# EAGLE design Babel Wing Rev A (EAGLE 9.4.2)
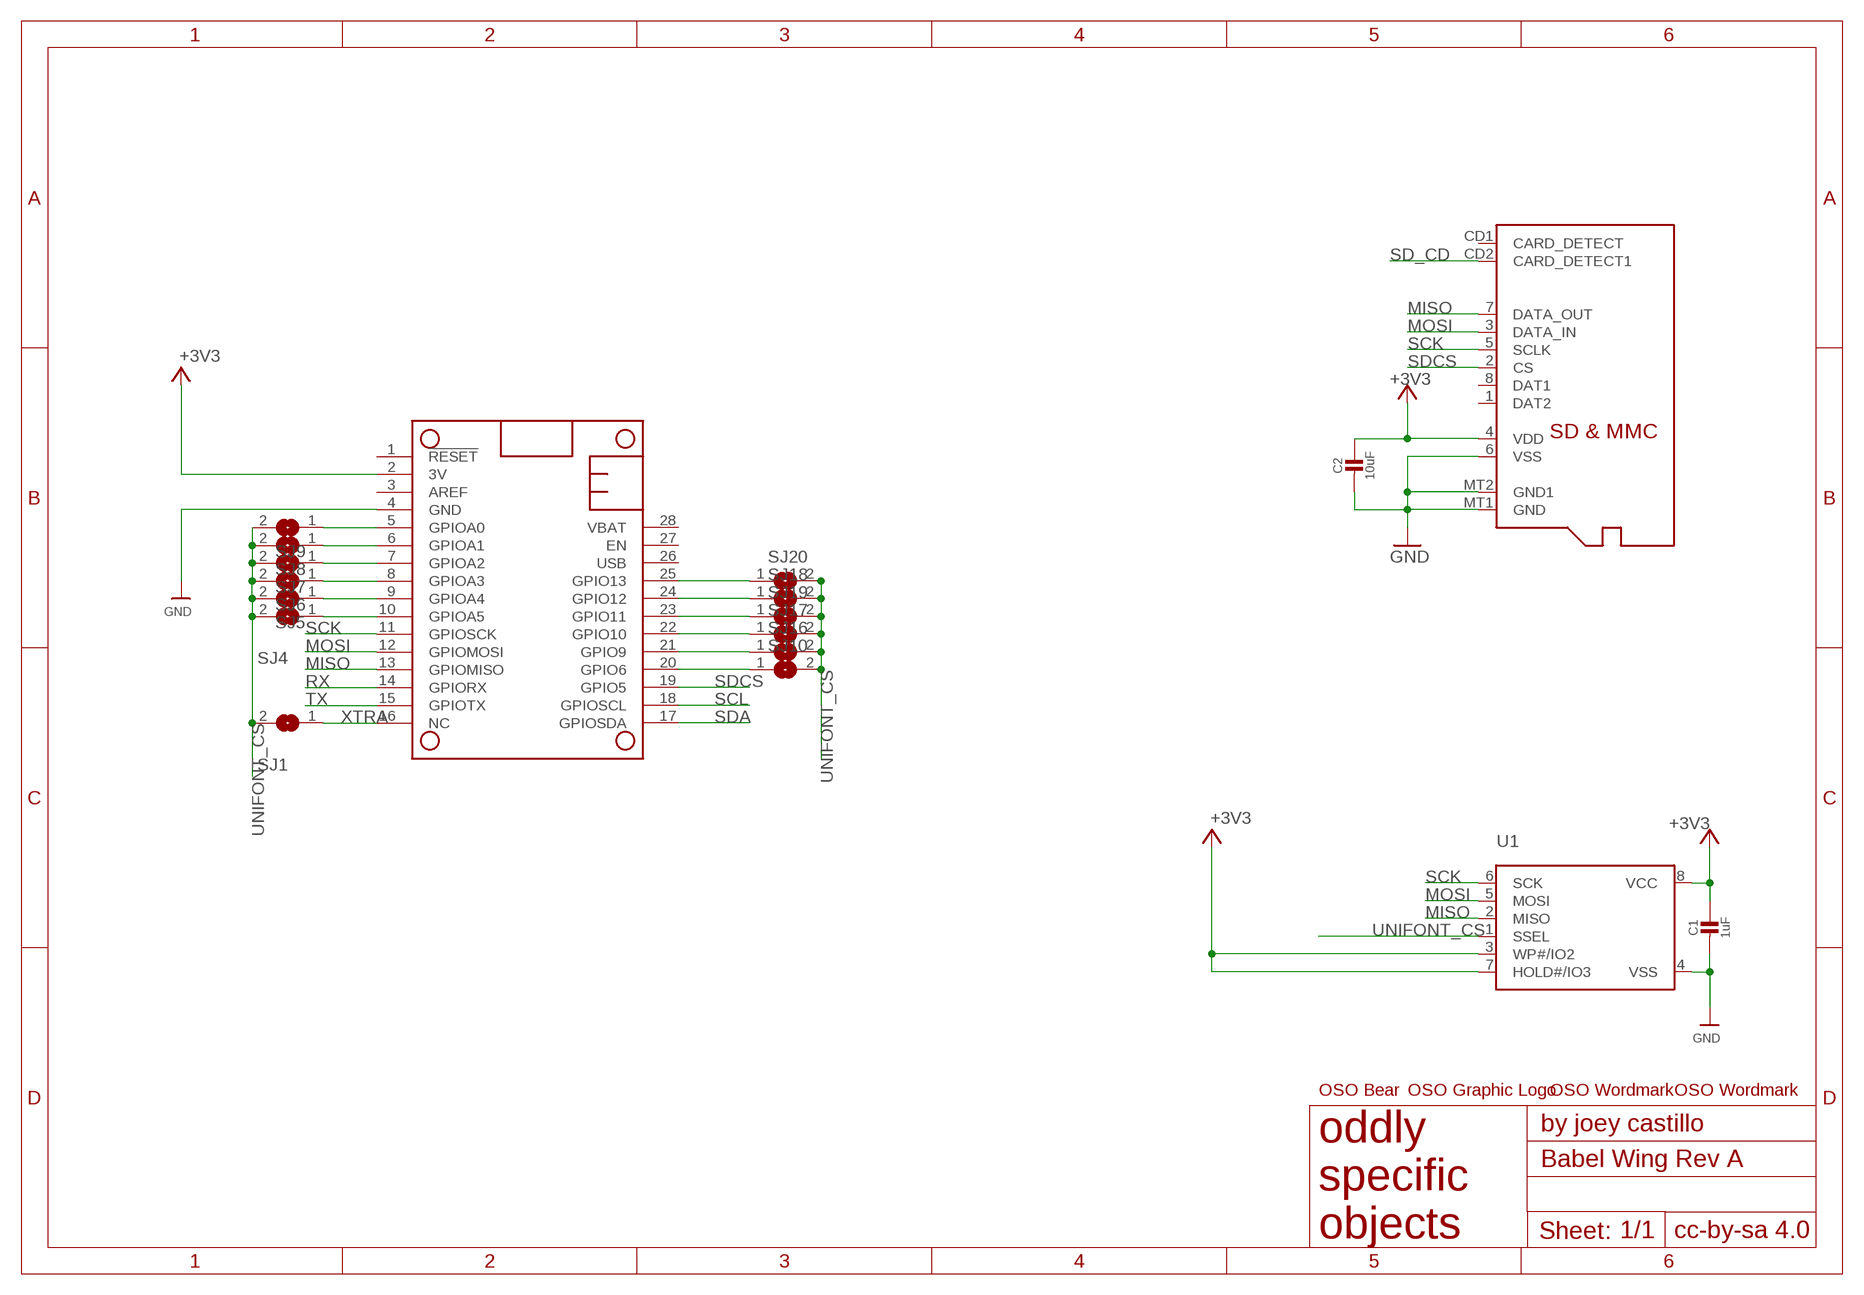
[diagram p0: schematic, sheet 1]

## Parts
C1  1uF  CAP_CERAMIC0805_10MGAP  [0805_10MGAP]
C2  10uF  CAP_CERAMIC0805_10MGAP  [0805_10MGAP]
MICROSD  MICROSD  [MICROSD]
MS1  FEATHERWING  [FEATHERWING]
SJ1  SOLDERJUMPER  [SOLDERJUMPER_ARROW_NOPASTE]
SJ4  SOLDERJUMPER  [SOLDERJUMPER_ARROW_NOPASTE]
SJ5  SOLDERJUMPER  [SOLDERJUMPER_ARROW_NOPASTE]
SJ6  SOLDERJUMPER  [SOLDERJUMPER_ARROW_NOPASTE]
SJ7  SOLDERJUMPER  [SOLDERJUMPER_ARROW_NOPASTE]
SJ8  SOLDERJUMPER  [SOLDERJUMPER_ARROW_NOPASTE]
SJ9  SOLDERJUMPER  [SOLDERJUMPER_ARROW_NOPASTE]
SJ10  SOLDERJUMPER  [SOLDERJUMPER_ARROW_NOPASTE]
SJ16  SOLDERJUMPER  [SOLDERJUMPER_ARROW_NOPASTE]
SJ17  SOLDERJUMPER  [SOLDERJUMPER_ARROW_NOPASTE]
SJ18  SOLDERJUMPER  [SOLDERJUMPER_ARROW_NOPASTE]
SJ19  SOLDERJUMPER  [SOLDERJUMPER_ARROW_NOPASTE]
SJ20  SOLDERJUMPER  [SOLDERJUMPER_ARROW_NOPASTE]
U1  MICROBUILDER_SPIFLASH_SOIC8  [MICROBUILDER_SOIC8_150MIL]
U$2  OSO_BEAR  [OSO_BEAR_750MIL]
U$3  OSO_GRAPHIC  [OSO_GRAPHIC]
U$4  OSO_TEXT  [OSO_TEXT_435MIL]
U$5  OSO_TEXTOSO_TEXT_ONELINE_125MIL  [OSO_ONELINE_125MIL]

## Nets
+3V3: C1.1 C2.1 MICROSD.4(VDD) MS1.2(3V) U1.3(WP#/IO2) U1.7(HOLD#/IO3) U1.8(VCC)
GND: C1.2 C2.2 MICROSD.6(VSS) MICROSD.MT1(GND) MICROSD.MT2(GND1) MS1.4(GND) U1.4(VSS)
MISO: MICROSD.7(DATA_OUT) MS1.13(GPIOMISO) U1.2(MISO)
MOSI: MICROSD.3(DATA_IN) MS1.12(GPIOMOSI) U1.5(MOSI)
N$4: MS1.20(GPIO6) SJ10.1
N$10: MS1.10(GPIOA5) SJ4.1
N$11: MS1.9(GPIOA4) SJ5.1
N$12: MS1.8(GPIOA3) SJ6.1
N$13: MS1.7(GPIOA2) SJ7.1
N$14: MS1.6(GPIOA1) SJ8.1
N$15: MS1.5(GPIOA0) SJ9.1
N$16: MS1.25(GPIO13) SJ20.1
N$17: MS1.24(GPIO12) SJ18.1
N$19: MS1.23(GPIO11) SJ19.1
N$20: MS1.22(GPIO10) SJ17.1
N$21: MS1.21(GPIO9) SJ16.1
RX: MS1.14(GPIORX)
SCK: MICROSD.5(SCLK) MS1.11(GPIOSCK) U1.6(SCK)
SCL: MS1.18(GPIOSCL)
SD_CD: MICROSD.CD2(CARD_DETECT1)
SDA: MS1.17(GPIOSDA)
SDCS: MICROSD.2(CS) MS1.19(GPIO5)
TX: MS1.15(GPIOTX)
UNIFONT_CS: SJ1.2 SJ4.2 SJ5.2 SJ6.2 SJ7.2 SJ8.2 SJ9.2 SJ10.2 SJ16.2 SJ17.2 SJ18.2 SJ19.2 SJ20.2 U1.1(SSEL)
XTRA: MS1.16(NC) SJ1.1
Unconnected: MICROSD.1(DAT2) MICROSD.8(DAT1) MICROSD.CD1(CARD_DETECT) MS1.1(!RESET) MS1.3(AREF) MS1.26(USB) MS1.27(EN) MS1.28(VBAT)

## Library data of the parts
C1 C2 = microbuilder:CAP_CERAMIC: Ceramic Capacitors For new designs, use the packages preceded by an '_' character since they are more reliable: The following footprints should be used on most boards: _0402 - Standard footprint for regular board layouts _0603 - Standard footprint for regular board layouts _0805 - Standard footprint for regular board layouts _1206 - Standard footprint for regular board layouts For extremely tight-pitch boards where space is at a premium, the following 'micro-pitch' footprints can be used (smaller pads, no silkscreen outline, etc.): _0402MP - Micro-pitch footprint for very dense/compact boards _0603MP - Micro-pitch footprint for very dense/compact boards _0805MP - Micro-pitch footprint for very dense/compact boards _1206MP - Micro-pitch footprint for very dense/compact boards
MICROSD = adafruit:MICROSD: Micro-SD / Transflash card holder with SPI pinout For the 3M # 2908-05WB-MG and/or 4UCON #19656 push-push type
MS1 = microbuilder:FEATHERWING
SJ1 SJ4-SJ10 SJ16-SJ20 = microbuilder:SOLDERJUMPER: SMD Solder JUMPER Solder the two pads together to create a connection, or remove the solder to break it. REFLOW - Use this footprint for solder paste and reflow ovens. WAVE - Use this footprint for hand-soldering (larger pads). CLOSED - Has a trace between the two pads to ensure it is closed by default. The trace needs to be cut to disable the jumper, and can be closed again by creating a solder bridge between the two pads.; BOM: EXCLUDE
U1 = Adafruit Feather M0 Express:MICROBUILDER_SPIFLASH_SOIC8: SOIC8 SPI Flash Be careful with the size since SOIC8 flash comes in several 'widths' SOIC8 150 mil M25P16 - 16Mbit (2Mbit x 8) Serial Flash (75MHz SPI Bus), Supply: 2.7-3.6V Digikey: SOIC8 - M25P16-VMN6P-ND SOIC8 208 mil W25Q16BVSSIG - 16Mbit (2Mbit x 8) Serial Flash (104MHz SPI Bus), Supply: 2.7-3.6V Digikey: SOIC8 - W25Q16BVSSIG-ND
U$2 = My Stuff:OSO_BEAR
U$3 = My Stuff:OSO_GRAPHIC
U$4 U$5 = My Stuff:OSO_TEXT

## Net classes
1 power: width 0.305 mm, drill 0.305 mm
2 gnd: width 0.254 mm, drill 0.254 mm

## Board
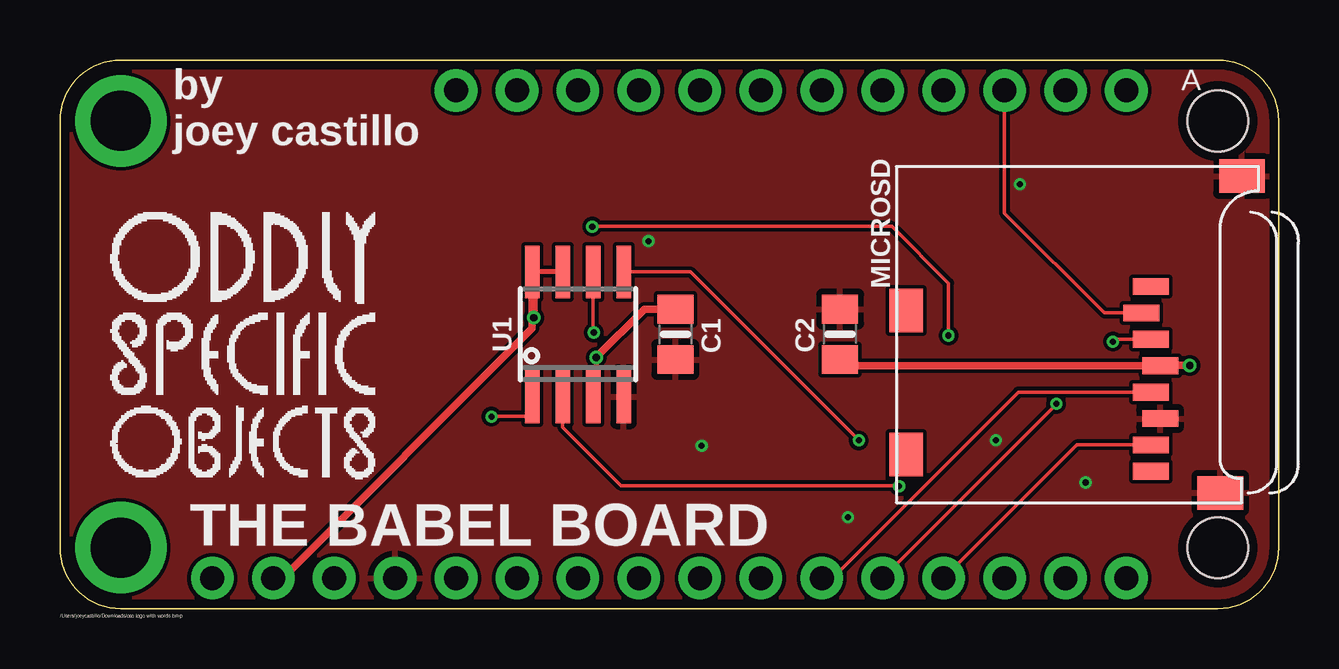
[diagram p1: board, top side]
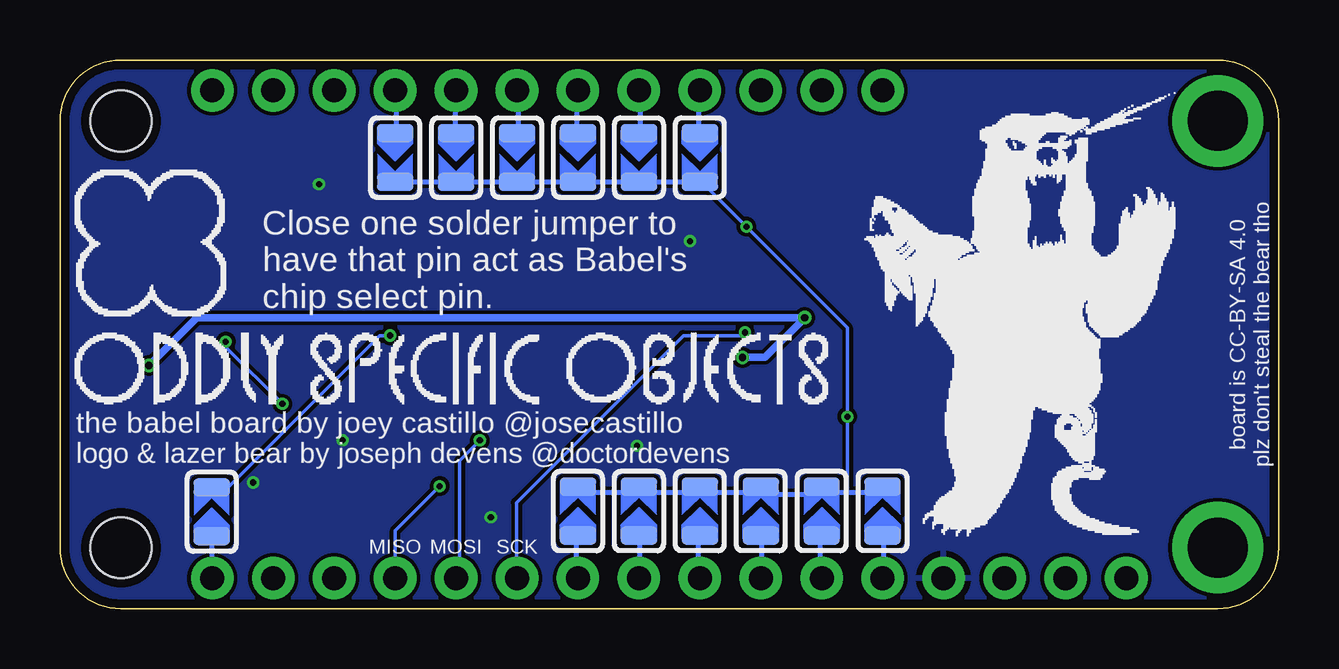
[diagram p2: board, bottom side, seen from below]

Size 50.8 x 22.86 mm. Coordinates in mm from the lower left corner, seen from the top.
Outline: 2.54,22.86 48.26,22.86 arc-90 50.8,20.32 50.8,2.54 arc-90 48.26,0 2.54,0 arc-90 0,2.54 0,20.32 arc-90 2.54,22.86
Copper layers (1*16): Top 0.035559375mm / dielectric 1.6mm / Bottom 0.035559375mm
Design rules "oshpark-2layer *": minimum track width 6mil, minimum drill 10mil, track to track 6mil, track to pad 6mil, pad to pad 6mil, via to via 6mil, smd to smd 6mil, copper to edge 15mil, drill to drill 6mil, minimum pad ring 5mil, minimum via ring 5mil, stop-mask expansion 2.5mil, vias tented up to drill 12mil, thermal gap 10mil

### Footprints (pad centres in the part's own frame; a part is rotated, then mirrored left to right if it is on the bottom)
0805_10MGAP = smd 1.2 x 1.5: 1 -1.05,0; 2 1.05,0
MICROSD = smd 0.7 x 1.5: 1 9,-10.64; 2 7.9,-10.24; 3 6.8,-10.64; 4 5.7,-11.04; 5 4.6,-10.64; 6 3.5,-11.04; 7 2.4,-10.64; 8 1.3,-10.64 | smd 1.8 x 1.4: CD1 2,-0.44; CD2 8,-0.44 | smd 1.4 x 1.9: MT1 0.4,-13.54; MT2 13.6,-14.44
FEATHERWING = drill 1 pad 1.778: 1 6.35,1.27; 2 8.89,1.27; 3 11.43,1.27; 4 13.97,1.27; 5 16.51,1.27; 6 19.05,1.27; 7 21.59,1.27; 8 24.13,1.27; 9 26.67,1.27; 10 29.21,1.27; 11 31.75,1.27; 12 34.29,1.27; 13 36.83,1.27; 14 39.37,1.27; 15 41.91,1.27; 16 44.45,1.27; 17 44.45,21.59; 18 41.91,21.59; 19 39.37,21.59; 20 36.83,21.59; 21 34.29,21.59; 22 31.75,21.59; 23 29.21,21.59; 24 26.67,21.59; 25 24.13,21.59; 26 21.59,21.59; 27 19.05,21.59; 28 16.51,21.59 | drill 2.5 pad 3.81: P$1 2.54,20.32; P$2 2.54,2.54 | hole 2.54: 48.26,20.32; 48.26,2.54
SOLDERJUMPER_ARROW_NOPASTE = smd 0.762 x 1.524: 1 -1.016,0; 2 1.016,0
MICROBUILDER_SOIC8_150MIL = smd 0.6 x 2.2: 1 -1.905,-2.6; 2 -0.635,-2.6; 3 0.635,-2.6; 4 1.905,-2.6; 5 1.905,2.6; 6 0.635,2.6; 7 -0.635,2.6; 8 -1.905,2.6

### Placement (x,y rotation side)
C1  25.65,11.43 270 top
C2  32.51,11.43 90 top
MICROSD  34.82,4.42 90 top
MS1  0,0 0 top
SJ1  44.48,4.04 90 bottom
SJ4  29.21,4.06 90 bottom
SJ5  26.67,4.06 90 bottom
SJ6  24.13,4.06 90 bottom
SJ7  21.59,4.06 90 bottom
SJ8  19.05,4.06 90 bottom
SJ9  16.51,4.06 90 bottom
SJ10  36.83,18.8 270 bottom
SJ16  34.29,18.8 270 bottom
SJ17  31.75,18.8 270 bottom
SJ18  26.67,18.8 270 bottom
SJ19  29.21,18.8 270 bottom
SJ20  24.13,18.8 270 bottom
U1  21.59,11.43 0 top
U$2  10.59,11.89 0 bottom
U$3  47.02,15.24 0 bottom
U$4  7.65,10.54 0 top
U$5  50.22,10.01 0 bottom

### Tracks (layer width: path | path; a pad name or v marks a point on that pad's centre or on a via)
+3V3  (via drill 0.3)
  Top 0.203: v22.35,10.46 22.35,8.96 U1.3 | U1.7 U1.8
  Top 0.305: MS1.2 9.04,1.12 9.04,1.04 19.68,11.68 U1.8 19.75,14.03 v19.75,12.12 | C1.1 24.37,12.48 v22.35,10.46 | v47.09,10.13 45.88,10.13 MICROSD.4 33.04,10.12 32.78,10.38 C2.1
  Bottom 0.305: v22.35,10.46 21.41,10.46 v19.75,12.12 45.1,12.12 v47.09,10.13
GND  (via drill 0.25)
  other vias: 24.54,15.32 26.75,6.78 40.01,17.68 39.01,7.01 42.75,5.26 32.84,3.81
  pour Bottom: -1.02,23.88 51.05,23.88 51.56,23.37 52.07,22.86 52.07,-0.51 51.31,-1.27 0,-1.27 -1.27,0 -1.27,23.62
  pour Top: -1.02,24.64 -2.03,24.64 -3.05,23.62 -3.05,0.51 0,-2.54 48.51,-2.54 53.09,2.03 53.09,24.38 52.83,24.64
MISO  (via drill 0.25)
  Top 0.152: MICROSD.7 42.38,6.82 MS1.13 | U1.2 20.95,7.56 23.39,5.13 34.95,5.13 v34.98,5.11
  Bottom 0.152: MS1.13 36.83,3.25 v34.98,5.11
MOSI  (via drill 0.25)
  Top 0.152: MICROSD.3 43.97,11.22 43.97,11.2 v43.89,11.12 | U1.5 26.28,14.03 v33.3,7.01 | MS1.12 41.53,8.51 v41.53,8.53
  Bottom 0.152: v33.3,7.01 34.14,6.17 34.14,1.42 MS1.12 | v41.53,8.53 43.89,10.9 v43.89,11.12
N$4
  Bottom 0.203: SJ10.1 36.78,19.91 36.78,21.54 MS1.20
N$10
  Bottom 0.203: SJ4.1 29.26,3.05 29.26,1.42 MS1.10
N$11
  Bottom 0.203: SJ5.1 26.62,3.05 26.62,1.42 MS1.9
N$12
  Bottom 0.203: SJ6.1 24.18,3.05 24.18,1.42 MS1.8
N$13
  Bottom 0.203: SJ7.1 21.54,3.05 21.54,1.42 MS1.7
N$14
  Bottom 0.203: SJ8.1 19.1,3.05 19.1,1.42 MS1.6
N$15
  Bottom 0.203: SJ9.1 16.46,3.05 16.46,1.42 MS1.5
N$16
  Bottom 0.203: SJ20.1 24.18,19.91 24.18,21.54 MS1.25
N$17
  Bottom 0.203: SJ18.1 26.62,19.91 26.62,21.54 MS1.24
N$19
  Bottom 0.203: SJ19.1 29.26,19.91 29.26,21.54 MS1.23
N$20
  Bottom 0.203: SJ17.1 31.7,19.91 31.7,21.54 MS1.22
N$21
  Bottom 0.203: SJ16.1 34.34,19.91 34.34,21.54 MS1.21
SCK  (via drill 0.25)
  Top 0.152: MICROSD.5 39.94,9.02 32.19,1.27 MS1.11 | U1.6 22.23,11.53 v22.25,11.51
  Bottom 0.152: v22.25,11.51 22.38,11.38 24.82,11.38 31.77,4.42 31.77,1.29 MS1.11
SDCS
  Top 0.152: MS1.19 39.37,16.48 43.53,12.32 MICROSD.2
UNIFONT_CS  (via drill 0.25)
  Top 0.152: v17.98,8 18,8.02 19.46,8.02 19.68,8.25 U1.1 | v37.03,11.38 37.03,13.56 34.67,15.93 22.2,15.93 v22.19,15.91
  Bottom 0.152: SJ20.2 24.05,17.78 v22.19,15.91 17.98,11.71 v17.98,8 17.98,4.85 | v37.03,11.38 37.47,11.38 43.79,5.05 SJ1.2
  Bottom 0.203: SJ9.2 16.74,4.85 17.98,4.85 18.82,4.85 SJ8.2 19.36,4.78 21.29,4.78 SJ7.2 21.82,4.85 23.9,4.85 SJ6.2 24.36,4.85 26.44,4.85 SJ5.2 26.9,4.85 28.98,4.85 SJ4.2 | SJ10.2 SJ16.2 SJ17.2 SJ19.2 SJ18.2 SJ20.2
XTRA
  Bottom 0.203: MS1.16 44.45,3 SJ1.1

### Text on the board
tPlace: by / joey castillo | A | THE BABEL BOARD | /Users/joeycastillo/Downloads/oso logo with words.bmp
bPlace: Close one solder jumper to / have that pin act as Babel's / chip select pin. | board is CC-BY-SA 4.0 / plz don't steal the bear tho | the babel board by joey castillo @josecastillo | logo & lazer bear by joseph devens @doctordevens | SCK | MOSI | MISO
tStop: @josecastillo